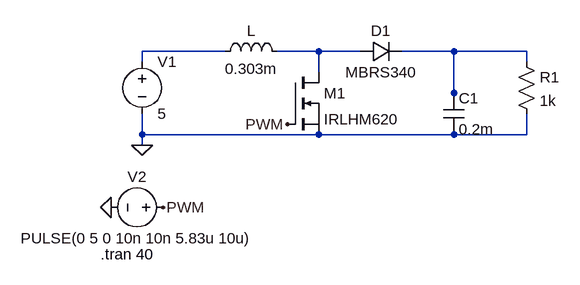
[diagram p0: schematic BOOST.asc]
BOOST.asc, the LTspice schematic file:
Version 4.1
SHEET 1 880 680
WIRE 128 96 0 96
WIRE 272 96 208 96
WIRE 336 96 272 96
WIRE 480 96 400 96
WIRE 592 96 480 96
WIRE 0 112 0 96
WIRE 592 112 592 96
WIRE 272 128 272 96
WIRE 480 160 480 96
WIRE 480 176 480 160
WIRE 0 224 0 192
WIRE 272 224 0 224
WIRE 480 224 272 224
WIRE 592 224 592 192
WIRE 592 224 480 224
WIRE 0 240 0 224
FLAG -48 336 0
FLAG 0 240 0
FLAG 32 336 PWM
FLAG 224 208 PWM
SYMBOL voltage 0 96 R0
WINDOW 123 0 0 Left 0
WINDOW 39 0 0 Left 0
SYMATTR InstName V1
SYMATTR Value 5
SYMBOL cap 464 160 R0
SYMATTR InstName C1
SYMATTR Value 0.2m
SYMATTR SpiceLine Rser=20m
SYMBOL voltage 48 336 R90
WINDOW 0 -32 56 VBottom 2
WINDOW 3 32 56 VTop 2
WINDOW 123 0 0 Left 0
WINDOW 39 0 0 Left 0
SYMATTR InstName V2
SYMATTR Value PULSE(0 5 0 10n 10n 5.83u 10u)
SYMBOL diode 336 112 R270
WINDOW 0 32 32 VTop 2
WINDOW 3 0 32 VBottom 2
SYMATTR InstName D1
SYMATTR Value MBRS340
SYMBOL nmos 224 128 R0
SYMATTR InstName M1
SYMATTR Value IRLHM620
SYMBOL res 576 96 R0
SYMATTR InstName R1
SYMATTR Value 1k
SYMBOL ind 112 112 R270
WINDOW 0 32 56 VTop 2
WINDOW 3 5 56 VBottom 2
SYMATTR InstName L
SYMATTR Value 0.303m
TEXT -64 408 Left 2 !.tran 40

The netlist it stands for:
* BOOST.asc
V1 N001 0 5
C1 N003 0 0.2m Rser=20m
V2 PWM 0 PULSE(0 5 0 10n 10n 5.83u 10u)
D1 N002 N003 MBRS340
M1 N002 PWM 0 0 IRLHM620
R1 N003 0 1k
L N001 N002 0.303m
.model D D
.lib standard.dio
.model NMOS NMOS
.model PMOS PMOS
.lib standard.mos
.tran 40
.backanno
.end